# EAGLE design ld-preamp (EAGLE 7.7.0)
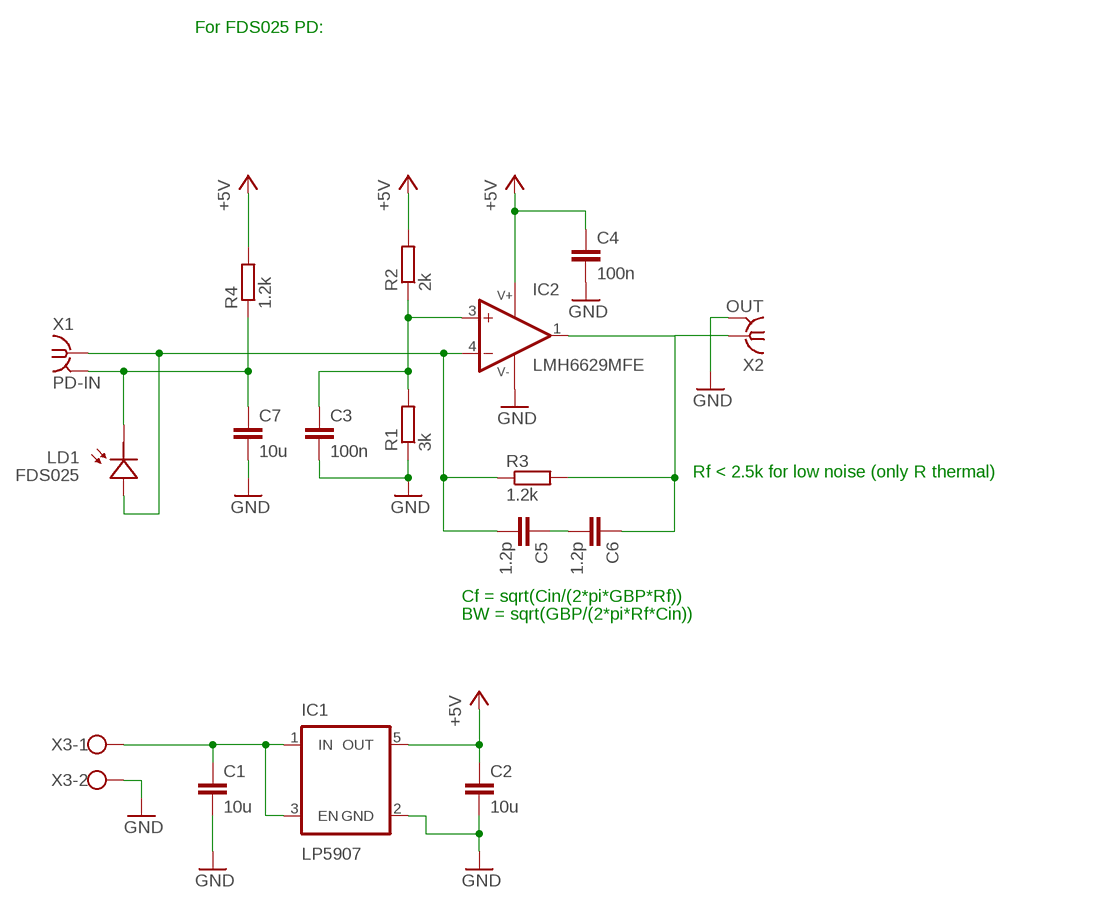
[diagram p0: schematic, sheet 1]

## Parts
C1  10u  C-EUC0805  [C0805]
C2  10u  C-EUC0805  [C0805]
C3  100n  C-EUC0603  [C0603]
C4  100n  C-EUC0603  [C0603]
C5  1.2p  C-EUC0603  [C0603]
C6  1.2p  C-EUC0603  [C0603]
C7  10u  C-EUC0805  [C0805]
IC1  LP5907  [SOT23-5]
IC2  LMH6629MFE  [SOT23-5]
LD1  FDS025  LD-TO46  [PD-TO46-EDGE]
R1  3k  R-EU_R0603  [R0603]
R2  2k  R-EU_R0603  [R0603]
R3  1.2k  R-EU_R0603  [R0603]
R4  1.2k  R-EU_R0603  [R0603]
X1  PD-IN  SMA-142-0711-821/826  [J502-ND-142-0711-821/826]
X2  OUT  SMA-142-0711-821/826  [J502-ND-142-0711-821/826]
X3  W237-102  [W237-102]

## Nets
+5V: C2.1 C4.1 IC1.5(OUT) IC2.5(V+) R2.2 R4.2
GND: C1.2 C2.2 C3.2 C4.2 C7.2 IC1.2(GND) IC2.2(V-) R1.1 X2.G@1 X2.G@2 X2.G@3 X2.G@4 X3.2
N$1: C1.1 IC1.1(IN) IC1.3(EN) X3.1
N$2: C3.1 IC2.3(+IN) R1.2 R2.1
N$5: C5.2 IC2.4(-IN) LD1.3(PDA) R3.1 X1.1
N$6: C5.1 C6.2
N$7: C6.1 IC2.1(OUT) R3.2 X2.1
N$8: C7.1 LD1.1(PDC) R4.1 X1.G@1 X1.G@2 X1.G@3 X1.G@4

## Notes on the sheet
- For FDS025 PD:
- Rf < 2.5k for low noise (only R thermal)
- Cf = sqrt(Cin/(2*pi*GBP*Rf))
- BW = sqrt(GBP/(2*pi*Rf*Cin))

## Library data of the parts
C1-C7 = rcl:C-EU: CAPACITOR, European symbol
IC1 = ld-preamp:LP5907
IC2 = ld-preamp:LMH6629MFE
LD1 = ld-preamp:LD-TO46
R1-R4 = rcl:R-EU_: RESISTOR, European symbol
X1 X2 = con-coax:SMA-: SMA 50 Ohm End Launch Jack Receptacle - Round Contact Johnson Components Source: www.johnsoncomponents.com .. J502-ND.pdf; MF: JOHNSON COMPONENTS; MPN: 142-0711-821; OC_FARNELL: 1019328; OC_NEWARK: 16F3627
X3 = con-wago-500:W237-102: WAGO SCREW CLAMP; MPN: 237-102; OC_FARNELL: unknown; OC_NEWARK: 70K9898

## Board
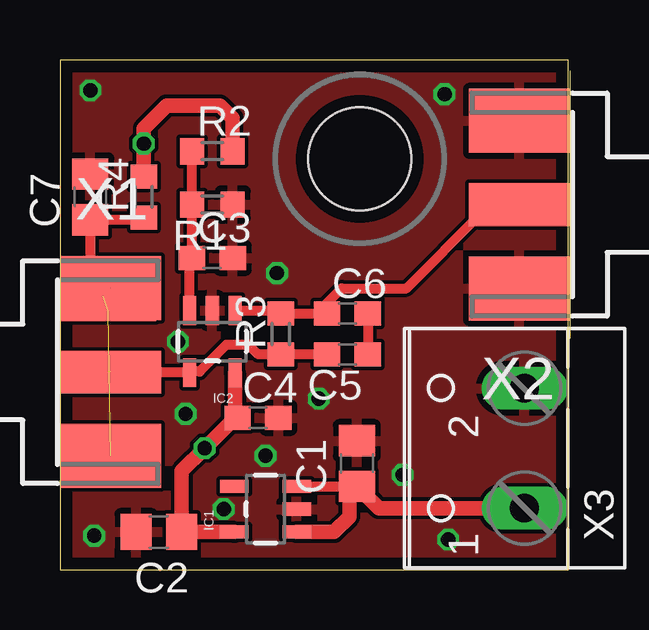
[diagram p1: board, top side]
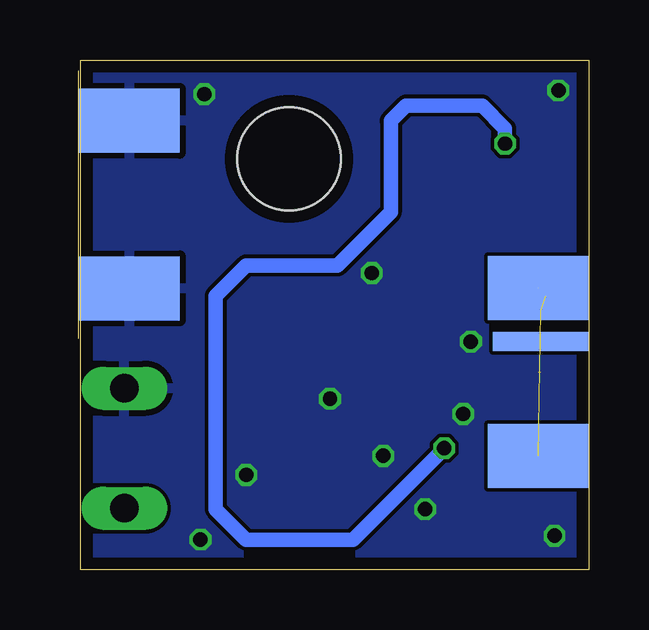
[diagram p2: board, bottom side, seen from below]

Size 21.19 x 21.27 mm. Coordinates in mm from the lower left corner, seen from the top.
Outline: 0,0 21.19,0 21.19,21.27 0,21.27 0,0
Copper layers (1*16): Top 0.035mm / dielectric 1.6mm / Bottom 0.035mm
Design rules "Elecrow_2-layer_PCB_eagle_rule": minimum track width 6mil, minimum drill 12mil, track to track 6mil, track to pad 6mil, pad to pad 6mil, via to via 8mil, smd to smd 0mil, copper to edge 20mil, drill to drill 10mil, minimum pad ring 6mil, minimum via ring 6mil, stop-mask expansion 0mil, vias tented up to drill 100mil, thermal gap 10mil
Holes 4.3 mm at 12.5,17.14

### Footprints (pad centres in the part's own frame; a part is rotated, then mirrored left to right if it is on the bottom)
C0805 = smd 1.3 x 1.5: 1 -0.95,0; 2 0.95,0
C0603 = smd 1.1 x 1: 1 -0.85,0; 2 0.85,0
SOT23-5 = smd 0.55 x 1.2: 1 -0.95,-1.3; 2 0,-1.3; 3 0.95,-1.3; 4 0.95,1.3; 5 -0.95,1.3
PD-TO46-EDGE = smd 4 x 0.8: 1 -2.118,0; 3 -2.118,-2.54 | smd 4 x 0.8 bottom: 2 -2.118,-1.27
R0603 = smd 1 x 1.1: 1 -0.85,0; 2 0.85,0
J502-ND-142-0711-821/826 = smd 4.191 x 1.778: 1 2.115,0 | smd 4.191 x 2.667: G@1 2.115,3.495; G@2 2.115,-3.495 | smd 4.191 x 2.667 bottom: G@3 2.115,3.495; G@4 2.115,-3.495
W237-102 = drill 1.194 long: 1 -2.5,-1.27; 2 2.5,-1.27

### Placement (x,y rotation side)
C1  12.38,4.45 90 top
C2  4.13,1.59 180 top
C3  6.35,13.02 0 top
C4  8.25,6.35 0 top
C5  11.99,8.99 180 top
C6  11.99,10.69 0 top
C7  1.27,15.56 90 top
IC1  8.57,2.54 90 top
IC2  6.35,9.53 180 top
LD1  4.13,10.79 0 top
R1  6.35,15.24 180 top
R2  6.35,17.46 0 top
R3  9.21,9.84 90 top
R4  3.49,15.56 90 top
X1  0,8.26 0 top
X2  21.27,15.24 180 top
X3  18.1,5.08 90 top

### Tracks (layer width: path | path; a pad name or v marks a point on that pad's centre or on a via)
+5V  (via drill 0.6)
  Top 0.61: IC1.5 C2.1 | IC2.5 7.3,6.46 C4.1 7.3,6.35 v6.03,5.08 5.08,4.13 C2.1 | C2.1 | R4.2 v3.49,17.78 3.49,18.41 4.45,19.37 6.67,19.37 7.2,18.84 R2.2
  Bottom 0.61: v3.49,17.78 3.49,18.41 4.45,19.37 7.62,19.37 8.25,18.73 8.25,14.92 10.48,12.7 14.29,12.7 15.56,11.43 15.56,2.54 14.29,1.27 9.84,1.27 v6.03,5.08
GND  (via drill 0.6)
  other vias: 1.27,20 16.03,19.84 16.19,1.27 1.43,1.43 5.24,6.51 10.79,7.14 9.05,12.38 14.29,3.97 4.92,9.53 6.83,2.54 8.57,4.76
  pour Top: 0,21.27 21.11,21.27 21.11,0 0,0
  pour Bottom: 0,21.27 21.11,21.27 21.11,-0.16 0,-0.16
N$1
  Top 0.406: IC1.3 C1.1
  Top 0.61: X3.1 13.3,2.58 C1.1 | C1.1 | IC1.1 11.43,1.59 12.06,2.22 12.06,3.18 C1.1
N$2
  Top 0.406: IC2.3 5.4,12.92 C3.1 R1.2 R2.1
N$5  (1 unrouted)
  Top 0.406: X1.1 5.37,8.26 IC2.4 5.46,8.28 5.82,8.28 6.93,9.39 7.87,9.39 8.27,8.99 R3.1 C5.2
N$6
  Top 0.406: C6.2 C5.1
N$7
  Top 0.406: IC2.1 9.07,10.82 R3.2 C6.1 11.14,11.14 11.75,11.75 14.45,11.75 17.62,14.92 18.84,14.92 X2.1
N$8  (4 unrouted)
  Top 0.406: R4.1 3.39,14.61 C7.1 1.27,11.75 1.59,11.43 1.79,11.43 X1.G@3